# EAGLE design Layer (EAGLE 9.6.2)
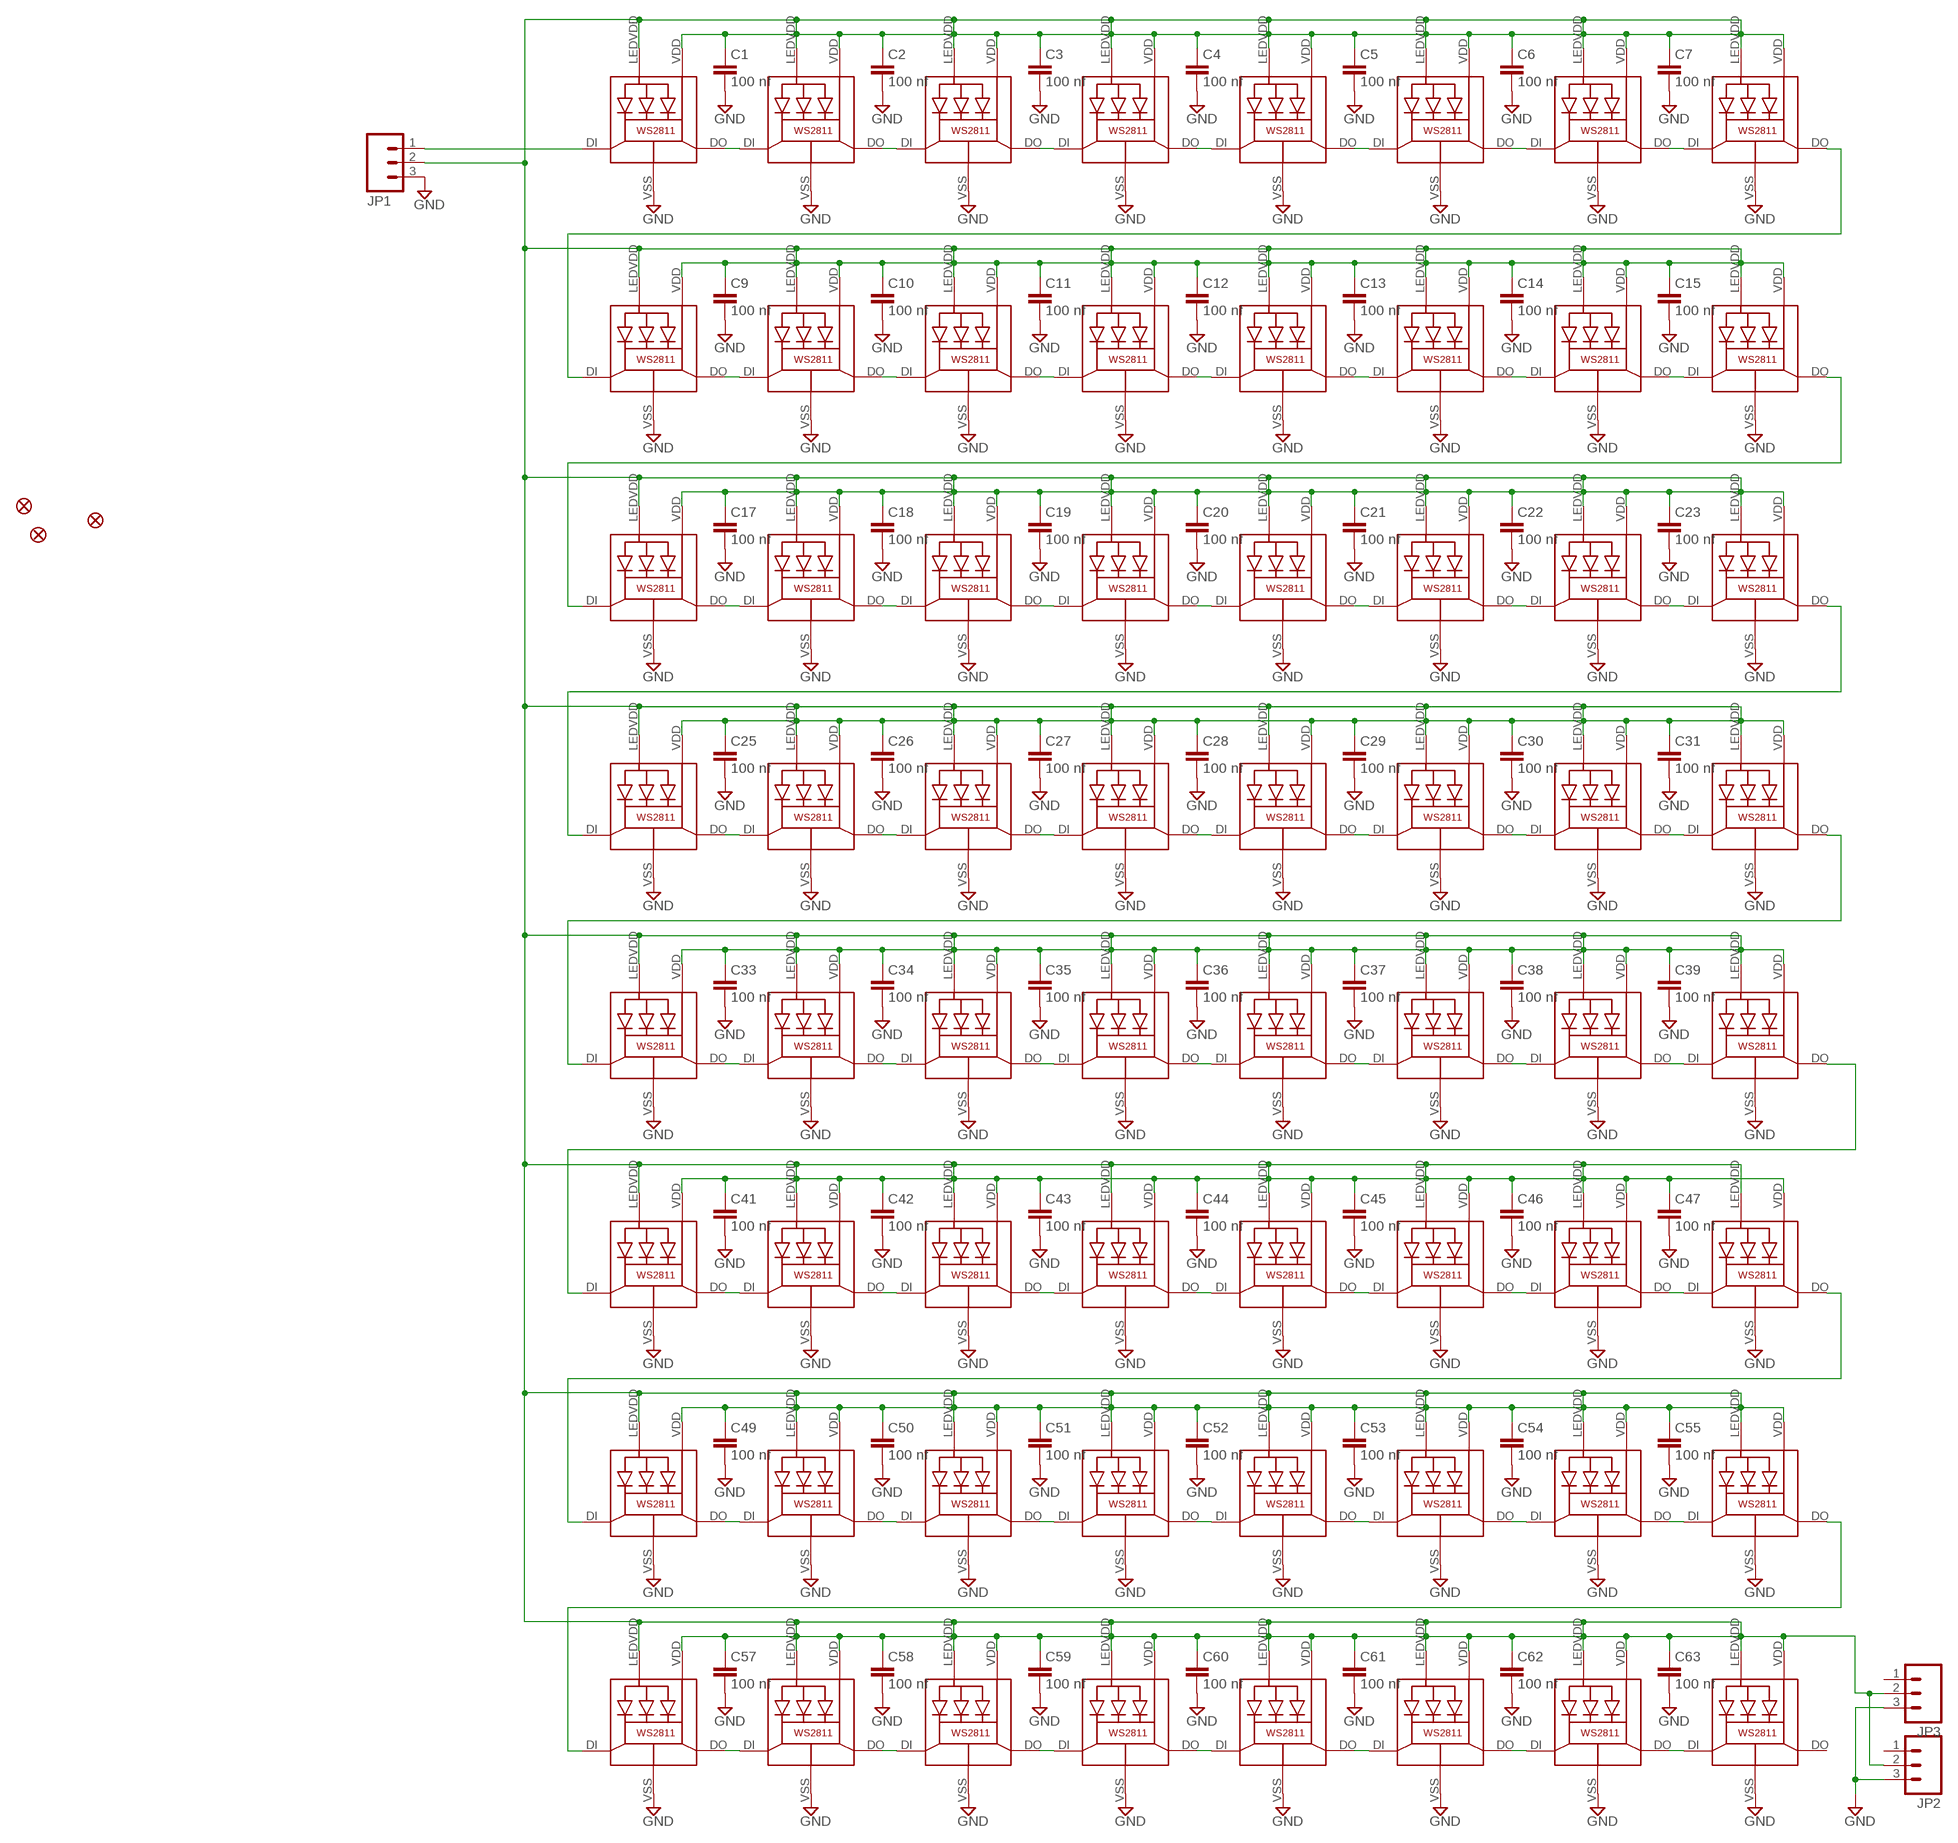
[diagram p0: schematic, sheet 1]

## Parts
C1  100 nf  C-EUC0805  [C0805]
C2  100 nf  C-EUC0805  [C0805]
C3  100 nf  C-EUC0805  [C0805]
C4  100 nf  C-EUC0805  [C0805]
C5  100 nf  C-EUC0805  [C0805]
C6  100 nf  C-EUC0805  [C0805]
C7  100 nf  C-EUC0805  [C0805]
C9  100 nf  C-EUC0805  [C0805]
C10  100 nf  C-EUC0805  [C0805]
C11  100 nf  C-EUC0805  [C0805]
C12  100 nf  C-EUC0805  [C0805]
C13  100 nf  C-EUC0805  [C0805]
C14  100 nf  C-EUC0805  [C0805]
C15  100 nf  C-EUC0805  [C0805]
C17  100 nf  C-EUC0805  [C0805]
C18  100 nf  C-EUC0805  [C0805]
C19  100 nf  C-EUC0805  [C0805]
C20  100 nf  C-EUC0805  [C0805]
C21  100 nf  C-EUC0805  [C0805]
C22  100 nf  C-EUC0805  [C0805]
C23  100 nf  C-EUC0805  [C0805]
C25  100 nf  C-EUC0805  [C0805]
C26  100 nf  C-EUC0805  [C0805]
C27  100 nf  C-EUC0805  [C0805]
C28  100 nf  C-EUC0805  [C0805]
C29  100 nf  C-EUC0805  [C0805]
C30  100 nf  C-EUC0805  [C0805]
C31  100 nf  C-EUC0805  [C0805]
C33  100 nf  C-EUC0805  [C0805]
C34  100 nf  C-EUC0805  [C0805]
C35  100 nf  C-EUC0805  [C0805]
C36  100 nf  C-EUC0805  [C0805]
C37  100 nf  C-EUC0805  [C0805]
C38  100 nf  C-EUC0805  [C0805]
C39  100 nf  C-EUC0805  [C0805]
C41  100 nf  C-EUC0805  [C0805]
C42  100 nf  C-EUC0805  [C0805]
C43  100 nf  C-EUC0805  [C0805]
C44  100 nf  C-EUC0805  [C0805]
C45  100 nf  C-EUC0805  [C0805]
C46  100 nf  C-EUC0805  [C0805]
C47  100 nf  C-EUC0805  [C0805]
C49  100 nf  C-EUC0805  [C0805]
C50  100 nf  C-EUC0805  [C0805]
C51  100 nf  C-EUC0805  [C0805]
C52  100 nf  C-EUC0805  [C0805]
C53  100 nf  C-EUC0805  [C0805]
C54  100 nf  C-EUC0805  [C0805]
C55  100 nf  C-EUC0805  [C0805]
C57  100 nf  C-EUC0805  [C0805]
C58  100 nf  C-EUC0805  [C0805]
C59  100 nf  C-EUC0805  [C0805]
C60  100 nf  C-EUC0805  [C0805]
C61  100 nf  C-EUC0805  [C0805]
C62  100 nf  C-EUC0805  [C0805]
C63  100 nf  C-EUC0805  [C0805]
FID1  FIDUCIAL""  [FIDUCIAL_1MM]
FID2  FIDUCIAL""  [FIDUCIAL_1MM]
FID3  FIDUCIAL""  [FIDUCIAL_1MM]
JP1  M03PTH  [1X03]
JP2  M03PTH  [1X03]
JP3  M03PTH  [1X03]
LED1  WS28115050  [WS28115050]
LED2  WS28115050  [WS28115050]
LED3  WS28115050  [WS28115050]
LED4  WS28115050  [WS28115050]
LED5  WS28115050  [WS28115050]
LED6  WS28115050  [WS28115050]
LED7  WS28115050  [WS28115050]
LED8  WS28115050  [WS28115050]
LED9  WS28115050  [WS28115050]
LED10  WS28115050  [WS28115050]
LED11  WS28115050  [WS28115050]
LED12  WS28115050  [WS28115050]
LED13  WS28115050  [WS28115050]
LED14  WS28115050  [WS28115050]
LED15  WS28115050  [WS28115050]
LED16  WS28115050  [WS28115050]
LED17  WS28115050  [WS28115050]
LED18  WS28115050  [WS28115050]
LED19  WS28115050  [WS28115050]
LED20  WS28115050  [WS28115050]
LED21  WS28115050  [WS28115050]
LED22  WS28115050  [WS28115050]
LED23  WS28115050  [WS28115050]
LED24  WS28115050  [WS28115050]
LED25  WS28115050  [WS28115050]
LED26  WS28115050  [WS28115050]
LED27  WS28115050  [WS28115050]
LED28  WS28115050  [WS28115050]
LED29  WS28115050  [WS28115050]
LED30  WS28115050  [WS28115050]
LED31  WS28115050  [WS28115050]
LED32  WS28115050  [WS28115050]
LED33  WS28115050  [WS28115050]
LED34  WS28115050  [WS28115050]
LED35  WS28115050  [WS28115050]
LED36  WS28115050  [WS28115050]
LED37  WS28115050  [WS28115050]
LED38  WS28115050  [WS28115050]
LED39  WS28115050  [WS28115050]
LED40  WS28115050  [WS28115050]
LED41  WS28115050  [WS28115050]
LED42  WS28115050  [WS28115050]
LED43  WS28115050  [WS28115050]
LED44  WS28115050  [WS28115050]
LED45  WS28115050  [WS28115050]
LED46  WS28115050  [WS28115050]
LED47  WS28115050  [WS28115050]
LED48  WS28115050  [WS28115050]
LED49  WS28115050  [WS28115050]
LED50  WS28115050  [WS28115050]
LED51  WS28115050  [WS28115050]
LED52  WS28115050  [WS28115050]
LED53  WS28115050  [WS28115050]
LED54  WS28115050  [WS28115050]
LED55  WS28115050  [WS28115050]
LED56  WS28115050  [WS28115050]
LED57  WS28115050  [WS28115050]
LED58  WS28115050  [WS28115050]
LED59  WS28115050  [WS28115050]
LED60  WS28115050  [WS28115050]
LED61  WS28115050  [WS28115050]
LED62  WS28115050  [WS28115050]
LED63  WS28115050  [WS28115050]
LED64  WS28115050  [WS28115050]

## Nets
GND: C1.2 C2.2 C3.2 C4.2 C5.2 C6.2 C7.2 C9.2 C10.2 C11.2 C12.2 C13.2 C14.2 C15.2 C17.2 C18.2 C19.2 C20.2 C21.2 C22.2 C23.2 C25.2 C26.2 C27.2 C28.2 C29.2 C30.2 C31.2 C33.2 C34.2 C35.2 C36.2 C37.2 C38.2 C39.2 C41.2 C42.2 C43.2 C44.2 C45.2 C46.2 C47.2 C49.2 C50.2 C51.2 C52.2 C53.2 C54.2 C55.2 C57.2 C58.2 C59.2 C60.2 C61.2 C62.2 C63.2 JP1.3 JP2.3 JP3.3 LED1.VSS(GND) LED2.VSS(GND) LED3.VSS(GND) LED4.VSS(GND) LED5.VSS(GND) LED6.VSS(GND) LED7.VSS(GND) LED8.VSS(GND) LED9.VSS(GND) LED10.VSS(GND) LED11.VSS(GND) LED12.VSS(GND) LED13.VSS(GND) LED14.VSS(GND) LED15.VSS(GND) LED16.VSS(GND) LED17.VSS(GND) LED18.VSS(GND) LED19.VSS(GND) LED20.VSS(GND) LED21.VSS(GND) LED22.VSS(GND) LED23.VSS(GND) LED24.VSS(GND) LED25.VSS(GND) LED26.VSS(GND) LED27.VSS(GND) LED28.VSS(GND) LED29.VSS(GND) LED30.VSS(GND) LED31.VSS(GND) LED32.VSS(GND) LED33.VSS(GND) LED34.VSS(GND) LED35.VSS(GND) LED36.VSS(GND) LED37.VSS(GND) LED38.VSS(GND) LED39.VSS(GND) LED40.VSS(GND) LED41.VSS(GND) LED42.VSS(GND) LED43.VSS(GND) LED44.VSS(GND) LED45.VSS(GND) LED46.VSS(GND) LED47.VSS(GND) LED48.VSS(GND) LED49.VSS(GND) LED50.VSS(GND) LED51.VSS(GND) LED52.VSS(GND) LED53.VSS(GND) LED54.VSS(GND) LED55.VSS(GND) LED56.VSS(GND) LED57.VSS(GND) LED58.VSS(GND) LED59.VSS(GND) LED60.VSS(GND) LED61.VSS(GND) LED62.VSS(GND) LED63.VSS(GND) LED64.VSS(GND)
N$1: JP1.1 LED1.DI
N$2: LED8.DO LED9.DI
N$3: LED16.DO LED17.DI
N$4: LED24.DO LED25.DI
N$5: LED40.DO LED41.DI
N$6: LED32.DO LED33.DI
N$7: LED48.DO LED49.DI
N$8: LED56.DO LED57.DI
N$33: LED17.DO LED18.DI
N$34: LED25.DO LED26.DI
N$35: LED26.DO LED27.DI
N$36: LED2.DO LED3.DI
N$37: LED3.DO LED4.DI
N$38: LED4.DO LED5.DI
N$39: LED5.DO LED6.DI
N$40: LED6.DO LED7.DI
N$41: LED7.DO LED8.DI
N$42: LED10.DO LED11.DI
N$43: LED11.DO LED12.DI
N$44: LED12.DO LED13.DI
N$45: LED13.DO LED14.DI
N$46: LED14.DO LED15.DI
N$47: LED15.DO LED16.DI
N$48: LED18.DO LED19.DI
N$49: LED19.DO LED20.DI
N$50: LED20.DO LED21.DI
N$51: LED21.DO LED22.DI
N$52: LED22.DO LED23.DI
N$53: LED23.DO LED24.DI
N$54: LED27.DO LED28.DI
N$55: LED28.DO LED29.DI
N$56: LED29.DO LED30.DI
N$57: LED30.DO LED31.DI
N$58: LED31.DO LED32.DI
N$59: LED1.DO LED2.DI
N$60: LED9.DO LED10.DI
N$93: LED49.DO LED50.DI
N$94: LED57.DO LED58.DI
N$95: LED58.DO LED59.DI
N$96: LED34.DO LED35.DI
N$97: LED35.DO LED36.DI
N$98: LED36.DO LED37.DI
N$99: LED37.DO LED38.DI
N$100: LED38.DO LED39.DI
N$101: LED39.DO LED40.DI
N$102: LED42.DO LED43.DI
N$103: LED43.DO LED44.DI
N$104: LED44.DO LED45.DI
N$105: LED45.DO LED46.DI
N$106: LED46.DO LED47.DI
N$107: LED47.DO LED48.DI
N$108: LED50.DO LED51.DI
N$109: LED51.DO LED52.DI
N$110: LED52.DO LED53.DI
N$111: LED53.DO LED54.DI
N$112: LED54.DO LED55.DI
N$113: LED55.DO LED56.DI
N$114: LED59.DO LED60.DI
N$115: LED60.DO LED61.DI
N$116: LED61.DO LED62.DI
N$117: LED62.DO LED63.DI
N$118: LED63.DO LED64.DI
N$119: LED33.DO LED34.DI
N$120: LED41.DO LED42.DI
VDD: C1.1 C2.1 C3.1 C4.1 C5.1 C6.1 C7.1 C9.1 C10.1 C11.1 C12.1 C13.1 C14.1 C15.1 C17.1 C18.1 C19.1 C20.1 C21.1 C22.1 C23.1 C25.1 C26.1 C27.1 C28.1 C29.1 C30.1 C31.1 C33.1 C34.1 C35.1 C36.1 C37.1 C38.1 C39.1 C41.1 C42.1 C43.1 C44.1 C45.1 C46.1 C47.1 C49.1 C50.1 C51.1 C52.1 C53.1 C54.1 C55.1 C57.1 C58.1 C59.1 C60.1 C61.1 C62.1 C63.1 JP1.2 JP2.2 JP3.2 LED1.LEDVDD LED1.VDD LED2.LEDVDD LED2.VDD LED3.LEDVDD LED3.VDD LED4.LEDVDD LED4.VDD LED5.LEDVDD LED5.VDD LED6.LEDVDD LED6.VDD LED7.LEDVDD LED7.VDD LED8.LEDVDD LED8.VDD LED9.LEDVDD LED9.VDD LED10.LEDVDD LED10.VDD LED11.LEDVDD LED11.VDD LED12.LEDVDD LED12.VDD LED13.LEDVDD LED13.VDD LED14.LEDVDD LED14.VDD LED15.LEDVDD LED15.VDD LED16.LEDVDD LED16.VDD LED17.LEDVDD LED17.VDD LED18.LEDVDD LED18.VDD LED19.LEDVDD LED19.VDD LED20.LEDVDD LED20.VDD LED21.LEDVDD LED21.VDD LED22.LEDVDD LED22.VDD LED23.LEDVDD LED23.VDD LED24.LEDVDD LED24.VDD LED25.LEDVDD LED25.VDD LED26.LEDVDD LED26.VDD LED27.LEDVDD LED27.VDD LED28.LEDVDD LED28.VDD LED29.LEDVDD LED29.VDD LED30.LEDVDD LED30.VDD LED31.LEDVDD LED31.VDD LED32.LEDVDD LED32.VDD LED33.LEDVDD LED33.VDD LED34.LEDVDD LED34.VDD LED35.LEDVDD LED35.VDD LED36.LEDVDD LED36.VDD LED37.LEDVDD LED37.VDD LED38.LEDVDD LED38.VDD LED39.LEDVDD LED39.VDD LED40.LEDVDD LED40.VDD LED41.LEDVDD LED41.VDD LED42.LEDVDD LED42.VDD LED43.LEDVDD LED43.VDD LED44.LEDVDD LED44.VDD LED45.LEDVDD LED45.VDD LED46.LEDVDD LED46.VDD LED47.LEDVDD LED47.VDD LED48.LEDVDD LED48.VDD LED49.LEDVDD LED49.VDD LED50.LEDVDD LED50.VDD LED51.LEDVDD LED51.VDD LED52.LEDVDD LED52.VDD LED53.LEDVDD LED53.VDD LED54.LEDVDD LED54.VDD LED55.LEDVDD LED55.VDD LED56.LEDVDD LED56.VDD LED57.LEDVDD LED57.VDD LED58.LEDVDD LED58.VDD LED59.LEDVDD LED59.VDD LED60.LEDVDD LED60.VDD LED61.LEDVDD LED61.VDD LED62.LEDVDD LED62.VDD LED63.LEDVDD LED63.VDD LED64.LEDVDD LED64.VDD
Unconnected: JP2.1 JP3.1 LED64.DO

## Library data of the parts
C1-C7 C9-C15 C17-C23 C25-C31 C33-C39 C41-C47 C49-C55 C57-C63 = rcl:C-EU: CAPACITOR, European symbol; SPICEPREFIX: C
FID1-FID3 = microbuilder:FIDUCIAL: Fiducial Alignment Points Various fiducial points for machine vision alignment.; BOM: EXCLUDE
JP1-JP3 = neomatrix-8x8:M03: Header 3 Standard 3-pin 0.1" header. Use with straight break away headers (SKU : PRT-00116), right angle break away headers (PRT-00553), swiss pins (PRT-00743), machine pins (PRT-00117), and female headers (PRT-00115). Molex polarized connector foot print use with SKU : PRT-08232 with associated crimp pins and housings.
LED1 = neomatrix-8x8:WS28115050; SPICEPREFIX: X
LED2-LED64 = neomatrix-8x8:WS28115050

## Board
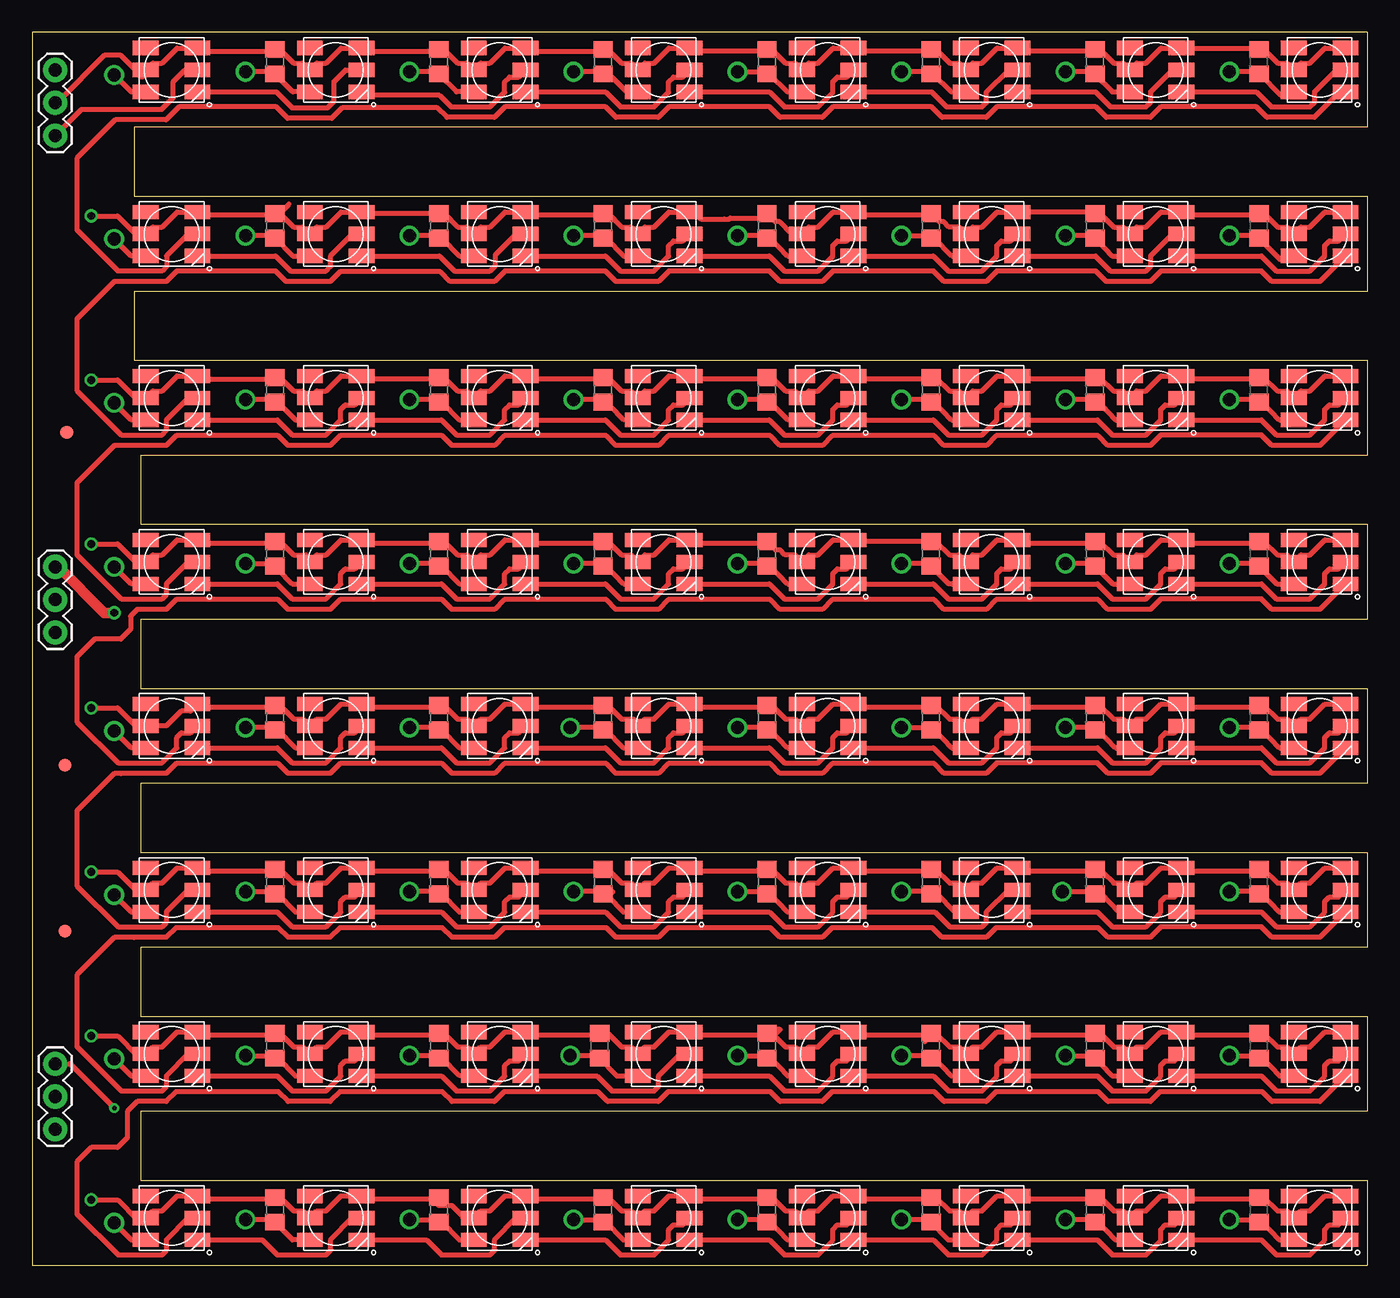
[diagram p1: board, top side]
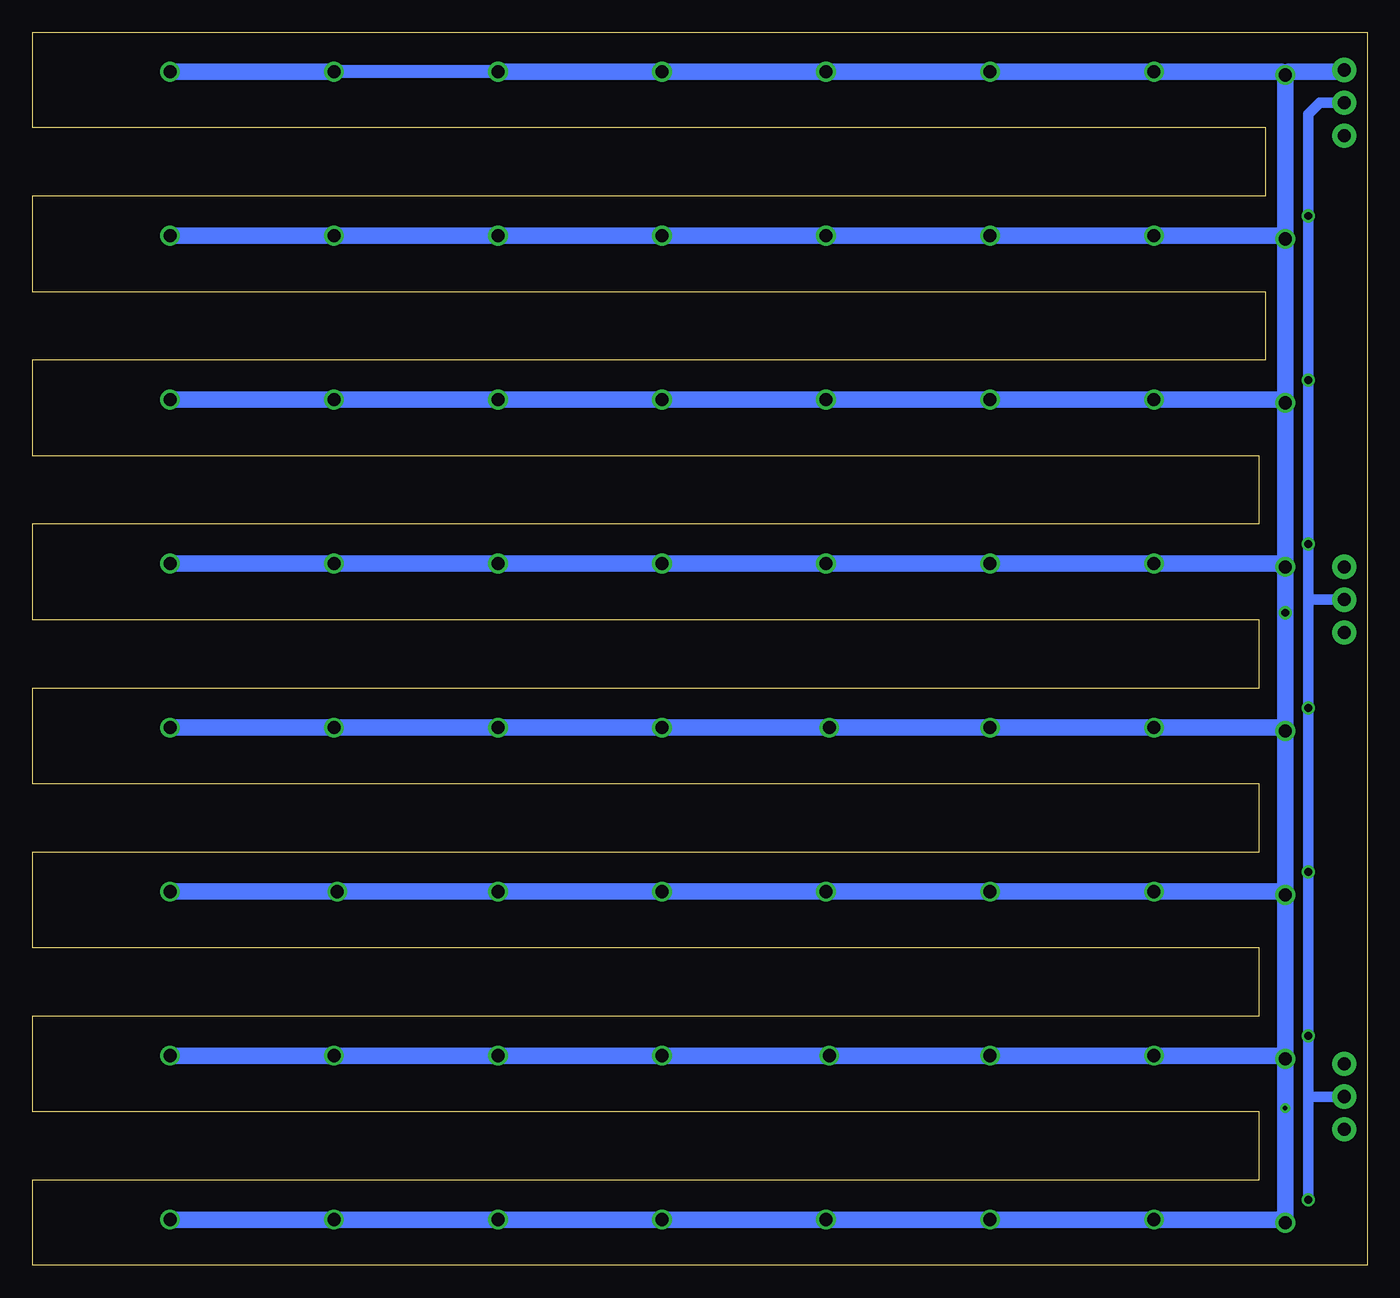
[diagram p2: board, bottom side, seen from below]

Size 103.38 x 95.5 mm. Coordinates in mm from the lower left corner, seen from the top.
Outline: 0,0 103.38,0 103.38,6.6 8.38,6.6 8.38,11.94 103.38,11.94 103.38,19.3 8.38,19.3 8.38,24.64 103.38,24.64 103.38,32 8.38,32 8.38,37.34 103.38,37.34 103.38,44.7 8.38,44.7 8.38,50.04 103.38,50.04 103.38,57.4 8.38,57.4 8.38,62.74 103.38,62.74 103.38,70.1 7.87,70.1 7.87,75.44 103.38,75.44 103.38,82.8 7.87,82.8 7.87,88.14 103.38,88.14 103.38,95.5 0,95.5 0,0
Copper layers (1*16): Top 0.035mm / dielectric 1.5mm / Bottom 0.035mm
Design rules "adafruit_rules_1 *": minimum track width 16mil, minimum drill 15.5mil, track to track 16mil, track to pad 16mil, pad to pad 16mil, via to via 16mil, smd to smd 16mil, copper to edge 16mil, drill to drill 16mil, minimum pad ring 10mil, minimum via ring 8mil, stop-mask expansion 4mil, vias tented up to drill 25mil, thermal gap 10mil

### Footprints (pad centres in the part's own frame; a part is rotated, then mirrored left to right if it is on the bottom)
C0805 = smd 1.3 x 1.5: 1 -0.95,0; 2 0.95,0
FIDUCIAL_1MM = smd 1 x 1: 1 0,0
1X03 = drill 1.016 pad 1.88: 1 0,0; 2 2.54,0; 3 5.08,0
WS28115050 = smd 2 x 1.1: DI 2,0; DO 2,-1.7; LEDVDD -2,0; NC -2,1.7; VDD 2,1.7; VSS -2,-1.7

### Placement (x,y rotation side)
C1  18.8,93.22 270 top
C2  31.5,93.22 270 top
C3  44.2,93.22 270 top
C4  56.9,93.22 270 top
C5  69.6,93.22 270 top
C6  82.3,93.22 270 top
C7  95,93.22 270 top
C9  18.8,80.52 270 top
C10  31.5,80.52 270 top
C11  44.2,80.52 270 top
C12  56.9,80.52 270 top
C13  69.6,80.52 270 top
C14  82.3,80.52 270 top
C15  95,80.52 270 top
C17  18.8,67.82 270 top
C18  31.5,67.82 270 top
C19  44.2,67.82 270 top
C20  56.9,67.82 270 top
C21  69.6,67.82 270 top
C22  82.3,67.82 270 top
C23  95,67.82 270 top
C25  18.8,55.12 270 top
C26  31.5,55.12 270 top
C27  44.2,55.12 270 top
C28  56.9,55.12 270 top
C29  69.6,55.12 270 top
C30  82.3,55.12 270 top
C31  95,55.12 270 top
C33  18.8,42.42 270 top
C34  31.5,42.42 270 top
C35  44.2,42.42 270 top
C36  56.9,42.42 270 top
C37  69.6,42.42 270 top
C38  82.3,42.42 270 top
C39  95,42.42 270 top
C41  18.8,29.72 270 top
C42  31.5,29.72 270 top
C43  44.2,29.72 270 top
C44  56.9,29.72 270 top
C45  69.6,29.72 270 top
C46  82.3,29.72 270 top
C47  95,29.72 270 top
C49  18.8,17.02 270 top
C50  31.5,17.02 270 top
C51  43.94,17.02 270 top
C52  56.9,17.02 270 top
C53  69.6,17.02 270 top
C54  82.3,17.02 270 top
C55  95,17.02 270 top
C57  18.8,4.32 270 top
C58  31.5,4.32 270 top
C59  44.2,4.32 270 top
C60  56.9,4.32 270 top
C61  69.6,4.32 270 top
C62  82.3,4.32 270 top
C63  95,4.32 270 top
FID1  2.67,64.52 0 top
FID2  2.54,25.91 0 top
FID3  2.54,38.73 0 top
JP1  1.78,87.5 90 top
JP2  1.78,10.54 90 top
JP3  1.78,49.02 90 top
LED1  10.79,92.58 0 top
LED2  23.5,92.58 0 top
LED3  36.2,92.58 0 top
LED4  48.89,92.58 0 top
LED5  61.59,92.58 0 top
LED6  74.3,92.58 0 top
LED7  87,92.58 0 top
LED8  99.69,92.58 0 top
LED9  10.79,79.88 0 top
LED10  23.5,79.88 0 top
LED11  36.2,79.88 0 top
LED12  48.89,79.88 0 top
LED13  61.59,79.88 0 top
LED14  74.3,79.88 0 top
LED15  87,79.88 0 top
LED16  99.69,79.88 0 top
LED17  10.79,67.18 0 top
LED18  23.5,67.18 0 top
LED19  36.2,67.18 0 top
LED20  48.89,67.18 0 top
LED21  61.59,67.18 0 top
LED22  74.3,67.18 0 top
LED23  87,67.18 0 top
LED24  99.69,67.18 0 top
LED25  10.79,54.48 0 top
LED26  23.5,54.48 0 top
LED27  36.2,54.48 0 top
LED28  48.89,54.48 0 top
LED29  61.59,54.48 0 top
LED30  74.3,54.48 0 top
LED31  87,54.48 0 top
LED32  99.69,54.48 0 top
LED33  10.79,41.78 0 top
LED34  23.5,41.78 0 top
LED35  36.2,41.78 0 top
LED36  48.89,41.78 0 top
LED37  61.59,41.78 0 top
LED38  74.3,41.78 0 top
LED39  87,41.78 0 top
LED40  99.69,41.78 0 top
LED41  10.79,29.08 0 top
LED42  23.5,29.08 0 top
LED43  36.2,29.08 0 top
LED44  48.89,29.08 0 top
LED45  61.59,29.08 0 top
LED46  74.3,29.08 0 top
LED47  87,29.08 0 top
LED48  99.69,29.08 0 top
LED49  10.79,16.38 0 top
LED50  23.5,16.38 0 top
LED51  36.2,16.38 0 top
LED52  48.89,16.38 0 top
LED53  61.59,16.38 0 top
LED54  74.3,16.38 0 top
LED55  87,16.38 0 top
LED56  99.69,16.38 0 top
LED57  10.79,3.68 0 top
LED58  23.5,3.68 0 top
LED59  36.2,3.68 0 top
LED60  48.89,3.68 0 top
LED61  61.59,3.68 0 top
LED62  74.3,3.68 0 top
LED63  87,3.68 0 top
LED64  99.69,3.68 0 top

### Tracks (layer width: path | path; a pad name or v marks a point on that pad's centre or on a via)
GND  (via drill 0.35, 0.61, 1.02)
  Top 0.406: C1.2 19.05,92.27 | LED3.VSS 32.84,90.88 31.5,92.23 C2.2 31.48,92.27 31.29,92.46 v29.21,92.46 | LED4.VSS 46.03,90.88 44.64,92.27 C3.2 44.01,92.46 v41.91,92.46 | 57.15,92.27 57.43,91.97 57.14,92.27 C4.2 | LED5.VSS 58.48,90.88 57.1,92.27 C4.2 | LED6.VSS 71.19,90.88 69.8,92.27 C5.2 69.55,92.27 69.36,92.46 v67.31,92.46 | LED7.VSS 83.64,90.88 83.64,90.92 C6.2 | LED8.VSS 97.44,90.63 96.69,90.63 95.11,92.27 C7.2 94.81,92.46 v92.71,92.46 | 35.05,78.23 35,78.18 LED11.VSS 33.09,78.18 31.75,79.57 C10.2 31.45,79.57 31.26,79.76 v29.21,79.76 | 46.15,78.22 46.86,78.22 LED12.VSS 45.78,78.18 44.45,79.57 C11.2 44.15,79.57 43.96,79.76 v41.91,79.76 | LED16.VSS 97.44,77.93 96.58,77.93 96.58,77.98 C15.2 94.95,79.57 94.76,79.76 v92.71,79.76 | C17.2 19.05,66.87 | LED18.VSS 20.38,65.48 19,66.87 C17.2 | LED19.VSS 33.09,65.48 31.75,66.87 C18.2 31.45,66.87 31.26,67.06 v29.21,67.06 | LED22.VSS 71.19,65.48 69.86,66.87 C21.2 69.55,66.87 69.36,67.06 v67.31,67.06 | LED23.VSS 83.89,65.48 82.83,66.58 82.54,66.87 C22.2 82.25,66.87 82.06,67.06 v80.01,67.06 | LED24.VSS 96.58,65.48 95.25,66.87 C23.2 94.95,66.87 94.76,67.06 v92.71,67.06 | LED26.VSS 20.14,52.78 19.05,53.91 C25.2 18.56,54.36 v16.51,54.36 | LED27.VSS 33.09,52.78 31.75,54.17 C26.2 31.45,54.17 31.26,54.36 v29.21,54.36 | LED28.VSS 45.79,52.78 44.46,54.17 C27.2 44.15,54.17 43.96,54.36 v41.91,54.36 | LED29.VSS 58.48,52.78 57.15,54.17 C28.2 56.85,54.17 56.66,54.36 v54.61,54.36 | C29.2 69.85,54.17 | 71.19,52.78 LED30.VSS 70.98,52.78 C29.2 | LED34.VSS 20.38,40.08 19.05,41.47 C33.2 18.75,41.47 18.56,41.66 v16.51,41.66 | LED35.VSS 33.09,40.08 31.75,41.47 C34.2 31.45,41.47 31.26,41.66 v29.21,41.66
  Top 0.406: LED36.VSS 45.78,40.08 44.45,41.47 C35.2 44.15,41.47 43.96,41.66 v41.66,41.66 | LED37.VSS 58.48,40.08 57.15,41.47 C36.2 56.83,41.47 56.64,41.66 | LED38.VSS 71.19,40.08 69.85,41.47 C37.2 69.41,41.66 v67.31,41.66 | LED39.VSS 83.89,40.08 82.55,41.47 C38.2 82.25,41.47 82.06,41.66 v80.01,41.66 | LED40.VSS 96.58,40.08 95.25,41.47 C39.2 94.95,41.47 94.76,41.66 v92.71,41.66 | LED42.VSS 20.39,27.38 19.06,28.77 C41.2 18.56,28.96 v16.51,28.96 | LED43.VSS 33.09,27.38 31.75,28.77 C42.2 31.45,28.77 31.26,28.96 v29.21,28.96 | 44.61,28.6 45.78,27.38 LED44.VSS | 44.61,28.6 44.45,28.77 | LED45.VSS 58.48,27.38 57.15,28.77 C44.2 56.58,28.77 56.39,28.96 | LED46.VSS 71.45,27.38 70.11,28.77 C45.2 69.55,28.77 69.36,28.96 v67.31,28.96 | LED47.VSS 84.12,27.38 82.79,28.77 C46.2 81.96,28.77 81.92,28.81 81.74,28.96 v79.76,28.96 | LED48.VSS 96.58,27.38 95.25,28.77 C47.2 94.95,28.77 94.76,28.96 v92.71,28.96 | LED50.VSS 20.38,14.68 19.05,16.07 C49.2 18.56,16.26 v16.51,16.26 | LED51.VSS 34.75,14.68 34.8,14.73 33.04,14.73 31.75,16.07 C50.2 31.45,16.07 31.26,16.26 v29.21,16.26 | LED52.VSS 45.28,14.68 C51.2 43.89,16.07 43.7,16.26 v41.66,16.26 | LED53.VSS 58.48,14.68 57.15,16.07 C52.2 56.83,16.07 56.64,16.26 | LED54.VSS 71.19,14.68 69.86,16.07 C53.2 69.55,16.07 69.36,16.26 v67.31,16.26 | LED55.VSS 83.65,14.68 82.8,15.56 C54.2 82.23,16.07 82.04,16.26 | LED56.VSS 96.58,14.68 95.25,16.07 C55.2 94.68,16.07 94.49,16.26 | LED64.VSS 96.58,1.98 95.25,3.37 C63.2 94.68,3.37 94.49,3.56 | LED63.VSS 83.89,1.98 82.55,3.37 C62.2 81.98,3.37 81.79,3.56 v80.01,3.56 | LED62.VSS 70.94,1.98 C61.2 69.55,3.37 69.36,3.56 v67.31,3.56
  Top 0.406: LED61.VSS 58.48,1.98 57.15,3.37 C60.2 56.85,3.37 56.66,3.56 v54.61,3.56 | LED60.VSS 45.78,1.98 44.45,3.37 C59.2 43.96,3.56 v41.91,3.56 | LED59.VSS 33.09,1.98 31.75,3.37 C58.2 31.31,3.56 v29.21,3.56 | LED13.VSS 58.48,78.18 57.15,79.57 C12.2 56.85,79.57 56.66,79.76 v54.61,79.76 | LED14.VSS 71.23,78.18 69.85,79.57 C13.2 69.41,79.76 v67.31,79.76 | LED15.VSS 83.64,78.18 82.55,79.31 C14.2 82.11,79.76 v80.01,79.76 | C30.2 82.55,54.17 | C31.2 95.25,54.17 | v16.51,92.46 18.56,92.46 18.75,92.27 C1.2 | v80.01,92.46 82.06,92.46 82.25,92.27 C6.2 | v16.51,79.76 18.56,79.76 18.75,79.57 C9.2 | v16.51,67.06 18.56,67.06 18.75,66.87 C17.2 | v41.91,67.06 43.96,67.06 44.15,66.87 C19.2 44.46,66.87 44.74,66.58 45.83,65.48 LED20.VSS | v54.61,67.06 56.66,67.06 56.85,66.87 C20.2 57.14,66.87 58.53,65.48 LED21.VSS | v67.31,54.36 69.36,54.36 69.55,54.17 C29.2 | 56.66,41.66 56.64,41.66 | 56.64,41.66 v54.61,41.66 | v80.01,54.36 82.06,54.36 82.25,54.17 C30.2 | v92.71,54.36 94.76,54.36 94.95,54.17 C31.2 | v16.51,3.56 18.56,3.56 18.75,3.37 C57.2 18.95,3.22 18.95,3.19 20.16,1.98 LED58.VSS | 43.69,28.96 43.96,28.96 44.15,28.77 C43.2 | 43.69,28.96 v41.91,28.96 | v54.61,28.96 56.39,28.96 | 56.39,28.96 56.66,28.96 | v54.61,16.26 56.64,16.26 | 56.64,16.26 56.66,16.26 | v80.01,16.26 82.04,16.26 | 82.04,16.26 82.06,16.26 | v92.71,16.26 94.49,16.26 | 94.49,16.26 94.76,16.26 | v92.71,3.56 94.49,3.56 | 94.49,3.56 94.76,3.56 | LED9.VSS 7.67,78.18 v6.35,79.5 | LED17.VSS 7.67,65.48 v6.35,66.8 | LED25.VSS 7.67,52.78 v6.35,54.1 | LED33.VSS 7.67,40.08 v6.35,41.4 | LED41.VSS 7.67,27.38 v6.35,28.7 | LED49.VSS 7.67,14.68 v6.35,16 | LED57.VSS 7.67,1.98 v6.35,3.3
  Top 0.406: v6.35,92.2 7.67,90.88 LED1.VSS | JP2.3 2.92,15.62 v6.35,12.19 | v54.61,92.46 56.71,92.46 C4.2 | C6.2 82.83,91.73 82.83,91.72 | C9.2 19.05,79.57 | C9.2 20.18,78.18 LED10.VSS | C1.2 20.18,90.88 LED2.VSS | LED31.VSS 83.68,52.78 C30.2 | LED32.VSS 96.38,52.78 C31.2 | 44.45,28.77 44.77,28.77 44.96,28.96 44.64,28.96 44.45,28.77 | C43.2 43.88,28.77 43.69,28.96 | C43.2 44.36,28.6 44.61,28.6 | C43.2 44.49,28.47 44.73,28.47 | C43.2 44.45,28.77
  Top 0.813: JP3.3 2.03,54.1 5.59,50.55 v6.35,50.55
  Bottom 1.016: v67.31,92.46 v80.01,92.46
  Bottom 1.27: JP1.3 1.9,92.46 6.1,92.46 v6.35,92.2 | v6.35,92.2 6.6,92.46 v16.51,92.46 v29.21,92.46 v41.91,92.46 v54.61,92.46 v67.31,92.46 | v92.71,92.46 v80.01,92.46 | v6.35,92.2 v6.35,79.5 | v6.35,79.5 6.6,79.76 v16.51,79.76 v29.21,79.76 v41.91,79.76 v54.61,79.76 v67.31,79.76 v80.01,79.76 v92.71,79.76 | v6.35,79.5 v6.35,66.8 | v6.35,66.8 6.6,67.06 v16.51,67.06 v29.21,67.06 v41.91,67.06 v54.61,67.06 v67.31,67.06 v80.01,67.06 v92.71,67.06 | v6.35,66.8 v6.35,54.1 6.35,53.85 | v6.35,16 v6.35,28.7 | v6.35,28.7 v6.35,41.4 | v6.35,41.4 v6.35,50.55 6.35,53.85 | 6.35,53.85 6.86,54.36 v16.51,54.36 v29.21,54.36 v41.91,54.36 v54.61,54.36 v67.31,54.36 v80.01,54.36 v92.71,54.36 | v6.35,41.4 6.6,41.66 v16.51,41.66 v29.21,41.66 v41.66,41.66 v54.61,41.66 v67.31,41.66 v80.01,41.66 v92.71,41.66 | v6.35,28.7 6.6,28.96 v16.51,28.96 v29.21,28.96 v41.91,28.96 v54.61,28.96 v67.31,28.96 v79.76,28.96 v92.71,28.96 | v6.35,16 6.6,16.26 v16.51,16.26 v29.21,16.26 v41.66,16.26 v54.61,16.26 v67.31,16.26 v80.01,16.26 v92.71,16.26 | v92.71,3.56 v80.01,3.56 v67.31,3.56 v54.61,3.56 v41.91,3.56 v29.21,3.56 v16.51,3.56 6.6,3.56 v6.35,3.3 v6.35,12.19 v6.35,16
N$1
  Top 0.406: JP1.1 3.81,89.53 10.03,89.53 10.92,90.42 10.92,91.69 11.81,92.58 LED1.DI
N$2
  Top 0.406: LED9.DI 12.08,79.88 10.4,78.2 10.4,77.38 10.05,77.02 6.63,77.02 3.45,80.2 3.45,85.75 6.43,88.72 10.37,88.72 11.37,89.72 18.9,89.72 19.77,88.85 23.2,88.85 24.01,89.66 31.35,89.66 32.1,88.91 35.78,88.91 36.6,89.72 44.39,89.72 45.2,88.91 48.48,88.91 49.3,89.72 57.09,89.72 57.9,88.91 61.18,88.91 62,89.72 69.64,89.72 70.46,88.91 73.88,88.91 74.7,89.72 82.34,89.72 83.16,88.91 86.58,88.91 87.4,89.72 94.79,89.72 95.6,88.91 99.28,88.91 101.26,90.88 LED8.DO
N$3
  Top 0.406: LED16.DO 99.72,76.21 96,76.21 95.19,77.02 87.4,77.02 86.58,76.21 83.16,76.21 82.34,77.02 74.7,77.02 73.88,76.21 70.6,76.21 69.79,77.02 62,77.02 61.18,76.21 57.9,76.21 57.09,77.02 49.3,77.02 48.48,76.21 45.2,76.21 44.39,77.02 36.6,77.02 35.78,76.21 32.36,76.21 31.61,76.96 23.84,76.96 23.08,76.21 19.66,76.21 18.84,77.02 11.2,77.02 10.38,76.21 7.88,76.21 7.87,76.2 6.35,76.2 3.45,73.3 3.45,67.76 6.89,64.32 10.05,64.32 10.4,64.68 10.4,65.5 12.08,67.18 LED17.DI
N$4
  Top 0.406: LED24.DO 99.72,63.51 96,63.51 95.19,64.32 87.4,64.32 86.58,63.51 83.3,63.51 82.55,64.26 74.64,64.26 73.88,63.51 70.6,63.51 69.85,64.26 61.94,64.26 61.18,63.51 57.9,63.51 57.15,64.26 49.24,64.26 48.48,63.51 45.2,63.51 44.45,64.26 36.54,64.26 35.78,63.51 32.5,63.51 31.75,64.26 23.84,64.26 23.08,63.51 19.8,63.51 19.05,64.26 11.14,64.26 10.38,63.51 8.14,63.51 8.13,63.5 6.35,63.5 3.45,60.6 3.45,55.06 6.89,51.62 10.05,51.62 10.4,51.98 10.4,52.8 12.08,54.48 LED25.DI
N$5
  Top 0.406: LED40.DO 99.72,38.11 96,38.11 95.19,38.92 87.4,38.92 86.58,38.11 83.3,38.11 82.49,38.92 74.7,38.92 73.88,38.11 70.6,38.11 69.85,38.86 61.94,38.86 61.18,38.11 57.9,38.11 57.15,38.86 49.24,38.86 48.48,38.11 45.2,38.11 44.45,38.86 36.54,38.86 35.78,38.11 32.5,38.11 31.75,38.86 23.84,38.86 23.08,38.11 19.8,38.11 19.05,38.86 11.14,38.86 10.38,38.11 6.87,38.11 6.86,38.1 6.35,38.1 3.45,35.2 3.45,29.4 6.63,26.22 10.05,26.22 10.4,26.58 10.4,27.41 12.08,29.08 LED41.DI
N$6
  Top 0.406: LED32.DO 99.72,50.81 96,50.81 95.19,51.62 87.4,51.62 86.58,50.81 83.3,50.81 82.55,51.56 74.64,51.56 73.88,50.81 70.6,50.81 69.85,51.56 61.94,51.56 61.18,50.81 57.9,50.81 57.15,51.56 49.24,51.56 48.48,50.81 45.2,50.81 44.45,51.56 36.54,51.56 35.78,50.81 32.5,50.81 31.75,51.56 23.84,51.56 23.08,50.81 19.8,50.81 19.05,51.56 11.14,51.56 10.38,50.81 8.14,50.81 7.62,50.29 7.62,49.28 6.86,48.51 4.83,48.51 3.45,47.14 3.45,42.1 6.63,38.92 10.05,38.92 11.18,40.06 11.18,40.89 11.54,41.24 12.25,41.24 LED33.DI
N$7
  Top 0.406: LED48.DO 99.72,25.41 96,25.41 95.19,26.22 87.4,26.22 86.58,25.41 83.3,25.41 82.55,26.16 74.64,26.16 73.88,25.41 70.46,25.41 69.71,26.16 61.94,26.16 61.18,25.41 57.9,25.41 57.15,26.16 49.24,26.16 48.48,25.41 45.2,25.41 44.45,26.16 36.54,26.16 35.78,25.41 32.5,25.41 31.75,26.16 23.84,26.16 23.08,25.41 19.8,25.41 19.05,26.16 11.14,26.16 10.38,25.41 7.88,25.41 7.87,25.4 6.35,25.4 3.45,22.5 3.45,16.96 6.89,13.52 10.05,13.52 10.4,13.88 10.4,14.71 12.08,16.38 LED49.DI
N$8
  Top 0.406: LED56.DO 99.72,12.71 96,12.71 95.25,13.46 87.34,13.46 86.58,12.71 83.3,12.71 82.55,13.46 74.64,13.46 73.88,12.71 70.6,12.71 69.85,13.46 61.94,13.46 61.18,12.71 57.9,12.71 57.15,13.46 49.24,13.46 48.48,12.71 44.55,12.71 43.8,13.46 36.54,13.46 35.78,12.71 32.5,12.71 31.75,13.46 23.84,13.46 23.08,12.71 19.8,12.71 19.05,13.46 11.14,13.46 10.38,12.71 8.14,12.71 7.37,11.94 7.37,9.91 6.6,9.14 4.57,9.14 3.45,8.03 3.45,4 6.63,0.82 10.05,0.82 10.4,1.18 10.4,2 12.08,3.68 LED57.DI
N$33
  Top 0.406: LED17.DO 18.98,65.48 20.14,64.32 22.75,64.32 23.88,65.46 23.88,66.29 24.24,66.64 24.95,66.64 LED18.DI
N$34
  Top 0.406: LED25.DO 18.98,52.78 20.14,51.62 22.75,51.62 23.88,52.76 23.88,53.59 24.24,53.94 24.95,53.94 LED26.DI
N$35
  Top 0.406: LED26.DO 31.68,52.78 32.84,51.62 35.45,51.62 36.59,52.76 36.59,53.59 36.94,53.94 37.66,53.94 LED27.DI
N$36
  Top 0.406: LED2.DO 25.75,90.63 31.53,90.63 32.44,89.72 35.45,89.72 36.59,90.86 36.59,91.69 36.94,92.04 37.66,92.04 LED3.DI
N$37
  Top 0.406: LED3.DO 44.38,90.88 45.54,89.72 48.15,89.72 49.28,90.86 49.28,91.69 49.64,92.04 50.35,92.04 LED4.DI
N$38
  Top 0.406: LED4.DO 57.08,90.88 58.24,89.72 60.85,89.72 61.98,90.86 61.98,91.69 62.34,92.04 63.05,92.04 LED5.DI
N$39
  Top 0.406: LED6.DI 75.58,92.58 73.91,90.91 73.91,90.08 73.55,89.72 70.79,89.72 69.64,90.88 LED5.DO
N$40
  Top 0.406: LED7.DI 88.28,92.58 86.61,90.91 86.61,90.08 86.25,89.72 83.49,89.72 82.33,90.88 LED6.DO
N$41
  Top 0.406: LED8.DI 100.98,92.58 99.3,90.91 99.3,90.08 98.95,89.72 95.94,89.72 94.78,90.88 LED7.DO
N$42
  Top 0.406: LED11.DI 37.48,79.88 35.87,78.27 35.87,77.44 35.45,77.02 32.69,77.02 31.53,78.18 LED10.DO
N$43
  Top 0.406: LED11.DO 44.38,78.18 45.54,77.02 48.15,77.02 49.28,78.16 49.28,78.99 49.64,79.34 50.35,79.34 LED12.DI
N$44
  Top 0.406: LED12.DO 57.08,78.18 58.24,77.02 60.85,77.02 61.98,78.16 61.98,78.99 62.34,79.34 63.05,79.34 LED13.DI
N$45
  Top 0.406: LED13.DO 69.78,78.18 70.94,77.02 73.55,77.02 74.69,78.16 74.69,78.99 75.04,79.34 75.75,79.34 LED14.DI
N$46
  Top 0.406: LED15.DI 88.28,79.88 86.61,78.2 86.61,77.38 86.25,77.02 83.49,77.02 82.33,78.18 LED14.DO
N$47
  Top 0.406: LED15.DO 95.18,78.18 96.34,77.02 98.95,77.02 100.08,78.16 100.08,78.99 100.44,79.34 101.16,79.34 LED16.DI
N$48
  Top 0.406: LED18.DO 31.68,65.48 32.84,64.32 35.45,64.32 36.59,65.46 36.59,66.29 36.94,66.64 37.66,66.64 LED19.DI
N$49
  Top 0.406: LED19.DO 44.38,65.48 45.54,64.32 48.15,64.32 49.28,65.46 49.28,66.29 49.64,66.64 50.35,66.64 LED20.DI
N$50
  Top 0.406: LED20.DO 57.08,65.48 58.24,64.32 60.85,64.32 61.98,65.46 61.98,66.29 62.34,66.64 63.05,66.64 LED21.DI
N$51
  Top 0.406: LED21.DO 69.78,65.48 70.94,64.32 73.55,64.32 74.69,65.46 74.69,66.29 75.04,66.64 75.75,66.64 LED22.DI
N$52
  Top 0.406: LED22.DO 82.48,65.48 83.64,64.32 86.25,64.32 87.39,65.46 87.39,66.29 87.74,66.64 88.45,66.64 LED23.DI
N$53
  Top 0.406: LED23.DO 95.18,65.48 96.34,64.32 98.95,64.32 100.08,65.46 100.08,66.29 100.44,66.64 101.16,66.64 LED24.DI
N$54
  Top 0.406: LED27.DO 44.38,52.78 45.54,51.62 48.15,51.62 49.28,52.76 49.28,53.59 49.64,53.94 50.35,53.94 LED28.DI
N$55
  Top 0.406: LED28.DO 57.08,52.78 58.24,51.62 60.85,51.62 61.98,52.76 61.98,53.59 62.34,53.94 63.05,53.94 LED29.DI
N$56
  Top 0.406: LED29.DO 69.78,52.78 70.94,51.62 73.55,51.62 74.69,52.76 74.69,53.59 75.04,53.94 75.75,53.94 LED30.DI
N$57
  Top 0.406: LED30.DO 82.48,52.78 83.64,51.62 86.25,51.62 87.39,52.76 87.39,53.59 87.74,53.94 88.45,53.94 LED31.DI
N$58
  Top 0.406: LED31.DO 95.18,52.78 96.34,51.62 98.95,51.62 100.08,52.76 100.08,53.59 100.44,53.94 101.16,53.94 LED32.DI
N$59
  Top 0.406: LED1.DO 18.89,90.88 20.11,89.66 22.86,89.66 23.37,90.17 23.37,91.69 24.26,92.58 LED2.DI
N$60
  Top 0.406: LED10.DI 24.78,79.88 23.11,78.2 23.11,77.38 22.75,77.02 19.99,77.02 18.84,78.18 LED9.DO
N$93
  Top 0.406: LED49.DO 18.98,14.68 20.14,13.52 22.75,13.52 23.88,14.66 23.88,15.49 24.24,15.84 24.95,15.84 LED50.DI
N$94
  Top 0.406: LED58.DI 24.78,3.68 23.11,2 23.11,1.18 22.75,0.82 18.98,0.82 17.82,1.98 LED57.DO
N$95
  Top 0.406: LED59.DI 37.48,3.68 35.8,2 35.8,1.18 35.45,0.82 31.68,0.82 30.52,1.98 LED58.DO
N$96
  Top 0.406: LED34.DO 31.68,40.08 32.84,38.92 35.45,38.92 36.59,40.06 36.59,40.89 36.94,41.24 37.66,41.24 LED35.DI
N$97
  Top 0.406: LED35.DO 44.38,40.08 45.54,38.92 48.15,38.92 49.28,40.06 49.28,40.89 49.64,41.24 50.35,41.24 LED36.DI
N$98
  Top 0.406: LED36.DO 57.08,40.08 58.24,38.92 60.85,38.92 61.98,40.06 61.98,40.89 62.34,41.24 63.05,41.24 LED37.DI
N$99
  Top 0.406: LED37.DO 69.78,40.08 70.94,38.92 73.55,38.92 74.69,40.06 74.69,40.89 75.04,41.24 75.75,41.24 LED38.DI
N$100
  Top 0.406: LED38.DO 82.48,40.08 83.64,38.92 86.25,38.92 87.39,40.06 87.39,40.89 87.74,41.24 88.45,41.24 LED39.DI
N$101
  Top 0.406: LED39.DO 95.18,40.08 96.34,38.92 98.95,38.92 100.08,40.06 100.08,40.89 100.44,41.24 101.16,41.24 LED40.DI
N$102
  Top 0.406: LED42.DO 31.68,27.38 32.84,26.22 35.45,26.22 36.59,27.36 36.59,28.19 36.94,28.54 37.66,28.54 LED43.DI
N$103
  Top 0.406: LED43.DO 44.38,27.38 45.54,26.22 48.15,26.22 49.28,27.36 49.28,28.19 49.64,28.54 50.35,28.54 LED44.DI
N$104
  Top 0.406: LED44.DO 57.08,27.38 58.24,26.22 60.85,26.22 61.98,27.36 61.98,28.19 62.34,28.54 63.05,28.54 LED45.DI
N$105
  Top 0.406: LED46.DI 75.58,29.08 73.91,27.41 73.91,26.58 73.55,26.22 71.05,26.22 69.89,27.38 LED45.DO
N$106
  Top 0.406: LED46.DO 82.48,27.38 83.64,26.22 86.25,26.22 87.39,27.36 87.39,28.19 87.74,28.54 88.45,28.54 LED47.DI
N$107
  Top 0.406: LED47.DO 95.18,27.38 96.34,26.22 98.95,26.22 100.08,27.36 100.08,28.19 100.44,28.54 101.16,28.54 LED48.DI
N$108
  Top 0.406: LED50.DO 31.68,14.68 32.84,13.52 35.45,13.52 36.59,14.66 36.59,15.49 36.94,15.84 37.66,15.84 LED51.DI
N$109
  Top 0.406: LED52.DI 50.18,16.38 48.51,14.71 48.51,13.88 48.15,13.52 44.89,13.52 43.73,14.68 LED51.DO
N$110
  Top 0.406: LED52.DO 57.08,14.68 58.24,13.52 60.85,13.52 61.98,14.66 61.98,15.49 62.34,15.84 63.05,15.84 LED53.DI
N$111
  Top 0.406: LED53.DO 69.78,14.68 70.94,13.52 73.55,13.52 74.69,14.66 74.69,15.49 75.04,15.84 75.75,15.84 LED54.DI
N$112
  Top 0.406: LED54.DO 82.48,14.68 83.64,13.52 86.25,13.52 87.39,14.66 87.39,15.49 87.74,15.84 88.45,15.84 LED55.DI
N$113
  Top 0.406: LED55.DO 95.18,14.68 96.34,13.52 98.95,13.52 100.08,14.66 100.08,15.49 100.44,15.84 101.16,15.84 LED56.DI
N$114
  Top 0.406: LED59.DO 44.38,1.98 45.54,0.82 48.15,0.82 49.28,1.96 49.28,2.79 49.64,3.14 50.35,3.14 LED60.DI
N$115
  Top 0.406: LED60.DO 57.08,1.98 58.24,0.82 60.85,0.82 61.98,1.96 61.98,2.79 62.34,3.14 63.05,3.14 LED61.DI
N$116
  Top 0.406: LED61.DO 69.78,1.98 70.94,0.82 73.55,0.82 74.69,1.96 74.69,2.79 75.04,3.14 75.75,3.14 LED62.DI
N$117
  Top 0.406: LED62.DO 82.48,1.98 83.64,0.82 86.25,0.82 87.39,1.96 87.39,2.79 87.74,3.14 88.45,3.14 LED63.DI
N$118
  Top 0.406: LED63.DO 95.18,1.98 96.34,0.82 98.95,0.82 100.08,1.96 100.08,2.79 100.44,3.14 101.16,3.14 LED64.DI
N$119
  Top 0.406: LED33.DO 18.98,40.08 20.14,38.92 22.75,38.92 23.88,40.06 23.88,40.89 24.24,41.24 24.95,41.24 LED34.DI
N$120
  Top 0.406: LED41.DO 18.98,27.38 20.14,26.22 22.75,26.22 23.88,27.36 23.88,28.19 24.24,28.54 24.95,28.54 LED42.DI
VDD  (via drill 0.61)
  Top 0.406: LED7.VDD 89.25,94.03 | LED10.VDD 25.75,81.33 | LED12.VDD 51.15,81.33 | 63.85,55.93 LED29.VDD 63.5,56.18 | 56.71,30.53 56.13,30.53 | 56.13,30.53 51.15,30.53 LED44.VDD 49.31,30.78 48.15,29.62 47.44,29.62 LED44.LEDVDD 46.35,29.62 45.64,29.62 44.6,30.67 | C46.1 | 30.99,5.13 31.36,5.13 C58.1 31.75,5.01 32,5.01 | 30.99,5.13 25.75,5.13 LED58.VDD 23.91,5.38 22.75,4.22 22.04,4.22 LED58.LEDVDD 20.95,4.22 20.24,4.22 19.2,5.27 | 31.87,94.2 31.9,94.17 | 31.9,94.17 32.94,93.12 33.66,93.12 LED3.LEDVDD 34.73,93.12 35.45,93.12 36.61,94.28 LED3.VDD 38.45,94.03 44.06,94.03 C3.1 44.6,94.17 | 44.55,94.22 44.6,94.17 | 44.6,94.17 45.64,93.12 46.35,93.12 LED4.LEDVDD 47.44,93.12 48.15,93.12 49.31,94.28 LED4.VDD 51.15,94.03 56.76,94.03 C4.1 57.3,94.17 | 57.25,94.22 57.3,94.17 | 57.3,94.17 58.34,93.12 59.05,93.12 LED5.LEDVDD 60.13,93.12 60.85,93.12 62.01,94.28 LED5.VDD 63.85,94.03 69.46,94.03 C5.1 70,94.17 | 69.95,94.22 70,94.17 | 82.65,94.22 82.7,94.17 | 82.7,94.17 83.74,93.12 84.45,93.12 LED7.LEDVDD 85.53,93.12 86.25,93.12 87.41,94.28 LED7.VDD | LED8.VDD 100.11,94.28 98.95,93.12 98.23,93.12 LED8.LEDVDD 97.16,93.12 96.44,93.12 95.4,94.17 C7.1 94.88,94.28 LED7.VDD | LED16.VDD 100.11,81.58 98.95,80.42 98.23,80.42 LED16.LEDVDD 97.16,80.42 96.44,80.42 95.4,81.47 C15.1 94.86,81.33 89.25,81.33 LED15.VDD 87.41,81.58 86.25,80.42 85.53,80.42 LED15.LEDVDD 84.45,80.42 83.74,80.42 82.65,81.52 82.6,81.47 C14.1 82.23,81.53 82.23,81.58 LED14.VDD 74.71,81.58 73.55,80.42 72.83,80.42 LED14.LEDVDD 71.75,80.42 71,80.42 70.6,80.83 70.24,80.83 C13.1 69.46,81.33 63.85,81.33 LED13.VDD 62.01,81.58 60.85,80.42 60.13,80.42 LED13.LEDVDD 58.84,79.88 57.9,80.83 57.54,80.83 56.99,81.37
  Top 0.406: LED12.VDD 49.31,81.58 48.15,80.42 47.44,80.42 LED12.LEDVDD 46.35,80.42 45.64,80.42 44.55,81.52 44.25,81.52 C11.1 44.06,81.33 38.45,81.33 LED11.VDD 36.61,81.58 35.45,80.42 34.73,80.42 LED11.LEDVDD 33.66,80.42 32.94,80.42 31.85,81.52 31.55,81.52 C10.1 25.61,81.47 LED10.VDD | 19.15,81.52 19.2,81.47 | 19.2,81.47 20.24,80.42 20.95,80.42 LED10.LEDVDD 22.04,80.42 22.75,80.42 23.91,81.58 LED10.VDD | LED26.LEDVDD 21.61,54.59 | 21.61,54.59 22.04,55.02 22.75,55.02 23.91,56.18 LED26.VDD 25.75,55.93 31.36,55.93 C26.1 31.55,56.12 31.85,56.12 32.94,55.02 33.66,55.02 LED27.LEDVDD 34.73,55.02 35.45,55.02 36.61,56.18 LED27.VDD 38.45,55.93 44.06,55.93 C27.1 44.25,56.12 44.55,56.12 45.64,55.02 46.35,55.02 LED28.LEDVDD 47.44,55.02 48.15,55.02 49.31,56.18 LED28.VDD 51.15,55.93 56.76,55.93 C28.1 57.54,55.43 57.9,55.43 58.3,55.02 59.05,55.02 LED29.LEDVDD 60.13,55.02 60.85,55.02 62.01,56.18 63.5,56.18 | 21.61,54.59 21.18,55.02 20.24,55.02 19.15,56.12 18.85,56.12 C25.1 18.66,55.93 13.05,55.93 LED25.VDD 11.21,56.18 10.05,55.02 9.33,55.02 LED25.LEDVDD 8,54.48 6.6,55.88 v4.57,55.88 | LED24.VDD 100.11,68.88 98.95,67.72 98.23,67.72 LED24.LEDVDD 97.16,67.72 96.44,67.72 95.35,68.82 95.05,68.82 C23.1 94.86,68.63 89.25,68.63 LED23.VDD 87.41,68.88 86.25,67.72 85.53,67.72 LED23.LEDVDD 84.45,67.72 83.74,67.72 82.65,68.82 82.35,68.82 C22.1 82.16,68.63 76.55,68.63 LED22.VDD 74.71,68.88 73.55,67.72 72.83,67.72 LED22.LEDVDD 71.75,67.72 71.04,67.72 69.95,68.82 69.9,68.77 C21.1 69.46,68.63 63.85,68.63 LED21.VDD 62.01,68.88 60.85,67.72 60.13,67.72 LED21.LEDVDD 59.05,67.72 58.34,67.72 57.25,68.82 57.2,68.77 C20.1 56.76,68.63 51.15,68.63 LED20.VDD 49.31,68.88 48.15,67.72 47.44,67.72 LED20.LEDVDD 46.35,67.72 45.64,67.72 44.55,68.82 44.25,68.82 C19.1 44.06,68.63 38.45,68.63 LED19.VDD 36.61,68.88 35.45,67.72 34.73,67.72 LED19.LEDVDD 33.66,67.72 32.94,67.72 31.85,68.82 31.55,68.82 C18.1 31.36,68.63 25.75,68.63 LED18.VDD 23.91,68.88 22.75,67.72 22.04,67.72 LED18.LEDVDD 20.95,67.72 20.24,67.72 19.15,68.82 18.85,68.82 C17.1 18.66,68.63 13.05,68.63 LED17.VDD 11.21,68.88 10.05,67.72 9.33,67.72 LED17.LEDVDD 8.67,67.06 8.13,67.06 6.6,68.58 v4.57,68.58
  Top 0.406: LED32.VDD 100.11,56.18 98.95,55.02 98.23,55.02 LED32.LEDVDD 97.16,55.02 96.44,55.02 95.35,56.12 95.05,56.12 C31.1 94.86,55.93 89.25,55.93 LED31.VDD 87.41,56.18 86.25,55.02 85.53,55.02 LED31.LEDVDD 84.45,55.02 83.74,55.02 82.65,56.12 82.35,56.12 C30.1 82.16,55.93 76.55,55.93 LED30.VDD 74.71,56.18 73.55,55.02 72.83,55.02 LED30.LEDVDD 71.75,55.02 71.04,55.02 69.95,56.12 69.65,56.12 C29.1 63.61,56.07 63.5,56.18 | LED40.VDD 100.11,43.48 98.95,42.32 98.23,42.32 LED40.LEDVDD 97.16,42.32 96.44,42.32 95.35,43.42 95.05,43.42 C39.1 94.86,43.23 89.25,43.23 LED39.VDD 87.41,43.48 86.25,42.32 85.53,42.32 LED39.LEDVDD 84.45,42.32 83.74,42.32 82.65,43.42 C38.1 82.11,43.23 76.55,43.23 LED38.VDD 74.71,43.48 73.55,42.32 72.83,42.32 LED38.LEDVDD 71.75,42.32 71.04,42.32 69.95,43.42 69.65,43.42 C37.1 69.46,43.23 63.85,43.23 LED37.VDD 62.01,43.48 60.85,42.32 60.13,42.32 LED37.LEDVDD 59.05,42.32 58.34,42.32 57.3,43.37 | LED48.VDD 100.11,30.78 98.95,29.62 98.23,29.62 LED48.LEDVDD 97.16,29.62 96.44,29.62 95.35,30.72 95.05,30.72 C47.1 94.86,30.53 89.25,30.53 LED47.VDD 87.41,30.78 86.25,29.62 85.53,29.62 85.11,29.19 | LED47.LEDVDD 85.11,29.19 | 85.11,29.19 84.68,29.62 83.74,29.62 82.95,30.41 82.55,30.41 C46.1 | 57.25,43.42 57.3,43.37 | LED36.LEDVDD 47.01,41.89 | 47.01,41.89 47.44,42.32 48.15,42.32 49.31,43.48 LED36.VDD 51.15,43.23 56.76,43.23 C36.1 57.3,43.37 | 47.01,41.89 46.58,42.32 45.64,42.32 44.55,43.42 44.25,43.42 C35.1 44.06,43.23 38.45,43.23 LED35.VDD 36.61,43.48 35.45,42.32 34.73,42.32 LED35.LEDVDD 33.66,42.32 32.94,42.32 31.85,43.42 31.55,43.42 C34.1 31.36,43.23 25.75,43.23 LED34.VDD 23.91,43.48 22.75,42.32 22.04,42.32 LED34.LEDVDD 20.95,42.32 20.24,42.32 19.15,43.42 18.85,43.42 C33.1 18.66,43.23 13.05,43.23 LED33.VDD 12.25,42.94 11.54,42.94 10.38,41.78 LED33.LEDVDD 8,41.78 6.6,43.18 v4.57,43.18
  Top 0.406: 44.55,30.72 44.6,30.67 | 31.85,18.02 31.9,17.97 | 31.9,17.97 32.94,16.92 33.66,16.92 LED51.LEDVDD 34.73,16.92 35.45,16.92 36.61,18.08 LED51.VDD 38.45,17.83 43.8,17.83 C51.1 44.6,17.97 | 44.55,18.02 44.6,17.97 | 44.6,17.97 45.64,16.92 46.35,16.92 LED52.LEDVDD 47.44,16.92 48.15,16.92 49.31,18.08 LED52.VDD 51.15,17.83 56.76,17.83 C52.1 | 19.15,5.32 19.2,5.27 | 33.34,3.68 LED59.LEDVDD | LED59.LEDVDD 34.73,4.22 35.45,4.22 36.61,5.38 LED59.VDD 38.45,5.13 44.06,5.13 C59.1 44.25,5.32 44.55,5.32 45.64,4.22 46.35,4.22 LED60.LEDVDD 47.44,4.22 48.15,4.22 49.31,5.38 LED60.VDD 51.15,5.13 56.76,5.13 C60.1 57.3,5.27 | 82.65,18.02 82.7,17.97 | 82.7,17.97 83.74,16.92 84.45,16.92 LED55.LEDVDD 85.53,16.92 86.25,16.92 87.41,18.08 LED55.VDD 89.25,17.83 94.86,17.83 C55.1 95.3,17.97 95.35,18.02 96.44,16.92 97.16,16.92 LED56.LEDVDD 98.23,16.92 98.95,16.92 100.11,18.08 LED56.VDD | 57.25,5.32 57.3,5.27 | 57.3,5.27 58.34,4.22 59.05,4.22 LED61.LEDVDD 60.13,4.22 60.85,4.22 62.01,5.38 LED61.VDD 63.85,5.13 69.46,5.13 C61.1 69.9,5.27 69.95,5.32 71.04,4.22 71.75,4.22 LED62.LEDVDD 72.83,4.22 73.55,4.22 74.71,5.38 LED62.VDD 76.55,5.13 82.16,5.13 C62.1 82.7,5.27 | 82.65,5.32 82.7,5.27 | 82.7,5.27 83.74,4.22 84.45,4.22 LED63.LEDVDD 85.53,4.22 86.25,4.22 87.41,5.38 LED63.VDD 89.25,5.13 94.86,5.13 C63.1 95.05,5.32 95.35,5.32 96.44,4.22 97.16,4.22 LED64.LEDVDD 98.23,4.22 98.95,4.22 100.11,5.38 LED64.VDD | v4.57,5.08 6.6,5.08 8.13,3.56 8.67,3.56 LED57.LEDVDD 9.33,4.22 10.05,4.22 11.21,5.38 LED57.VDD 13.05,5.13 18.66,5.13 C57.1 19.2,5.27 | v4.57,17.78 6.6,17.78 8.13,16.26 8.67,16.26 LED49.LEDVDD 9.33,16.92 10.05,16.92 11.21,18.08 LED49.VDD 13.05,17.83 18.66,17.83 C49.1 19.1,17.97 19.15,18.02 20.24,16.92 20.95,16.92 LED50.LEDVDD 22.04,16.92 22.75,16.92 23.91,18.08 LED50.VDD 25.75,17.83 31.36,17.83 C50.1 31.9,17.97
  Top 0.406: v4.57,30.48 6.6,30.48 8.13,28.96 8.67,28.96 LED41.LEDVDD 9.33,29.62 10.05,29.62 11.21,30.78 LED41.VDD 13.05,30.53 18.66,30.53 C41.1 18.85,30.72 19.15,30.72 20.24,29.62 20.95,29.62 LED42.LEDVDD 22.04,29.62 22.75,29.62 23.91,30.78 LED42.VDD 25.75,30.53 31.36,30.53 C42.1 31.55,30.72 31.85,30.72 32.94,29.62 33.66,29.62 LED43.LEDVDD 34.73,29.62 35.45,29.62 36.61,30.78 LED43.VDD 38.45,30.53 44.06,30.53 C43.1 44.6,30.67 | v4.57,81.28 6.6,81.28 8.13,79.76 8.67,79.76 LED9.LEDVDD 9.33,80.42 10.05,80.42 11.21,81.58 LED9.VDD 13.05,81.33 18.61,81.33 18.75,81.47 C9.1 | JP1.2 1.9,90.17 2.03,90.17 5.59,93.73 6.86,93.73 8,92.58 LED1.LEDVDD 9.33,93.12 10.05,93.12 11.21,94.28 LED1.VDD 13.05,94.03 18.66,94.03 C1.1 19.2,94.17 20.24,93.12 20.95,93.12 LED2.LEDVDD 22.04,93.12 22.75,93.12 23.91,94.28 LED2.VDD 25.75,94.03 31.42,94.03 31.5,94.11 C2.1 31.9,94.17 | 82.7,94.17 C6.1 82.16,94.03 76.55,94.03 LED6.VDD 74.71,94.28 73.55,93.12 72.83,93.12 LED6.LEDVDD 71.75,93.12 71.04,93.12 70,94.17 | C9.1 19.2,81.47 | C9.1 19.16,81.47 19.88,82.19 | 56.99,81.37 C12.1 | LED12.VDD 51.26,81.58 51.8,81.04 53.58,81.04 53.59,81.03 53.94,81.03 54.04,81.13 56.74,81.13 56.99,81.37 | 30.99,5.13 31.49,4.63 32.5,4.63 33.44,3.68 LED59.LEDVDD | 56.13,30.53 56.27,30.67 C44.1 57.2,30.67 57.25,30.72 58.34,29.62 59.05,29.62 LED45.LEDVDD 60.13,29.62 60.85,29.62 62.01,30.78 LED45.VDD 63.85,30.53 69.46,30.53 C45.1 69.65,30.72 69.95,30.72 71.04,29.62 71.75,29.62 LED46.LEDVDD 72.83,29.62 73.55,29.62 74.71,30.78 LED46.VDD 76.55,30.53 82.16,30.53 C46.1 | C52.1 57.59,17.97 57.91,18.29 57.22,18.29 C52.1
  Top 0.406: C52.1 57.2,17.97 57.25,18.02 58.34,16.92 59.05,16.92 LED53.LEDVDD 60.13,16.92 60.85,16.92 62.01,18.08 LED53.VDD 63.85,17.83 69.41,17.83 69.41,17.65 69.09,17.33 69.09,17.46 C53.1 69.9,17.97 69.95,18.02 71.04,16.92 71.75,16.92 LED54.LEDVDD 72.83,16.92 73.55,16.92 74.71,18.08 LED54.VDD 76.55,17.83 82.16,17.83 C54.1 82.7,17.97
  Top 0.813: LED1.LEDVDD 8.46,92.25
  Bottom 0.813: JP1.2 3.68,90.04 4.57,89.15 v4.57,81.28 v4.57,68.58 v4.57,55.88 4.57,51.56 | 4.57,51.56 v4.57,43.18 v4.57,30.48 v4.57,17.78 4.57,12.95 | 4.57,12.95 v4.57,5.08 | JP2.2 4.45,13.08 4.57,12.95 | JP3.2 4.57,51.56